# EAGLE design H09R00 (EAGLE 9.2.2)

## Sheet 1 of 2
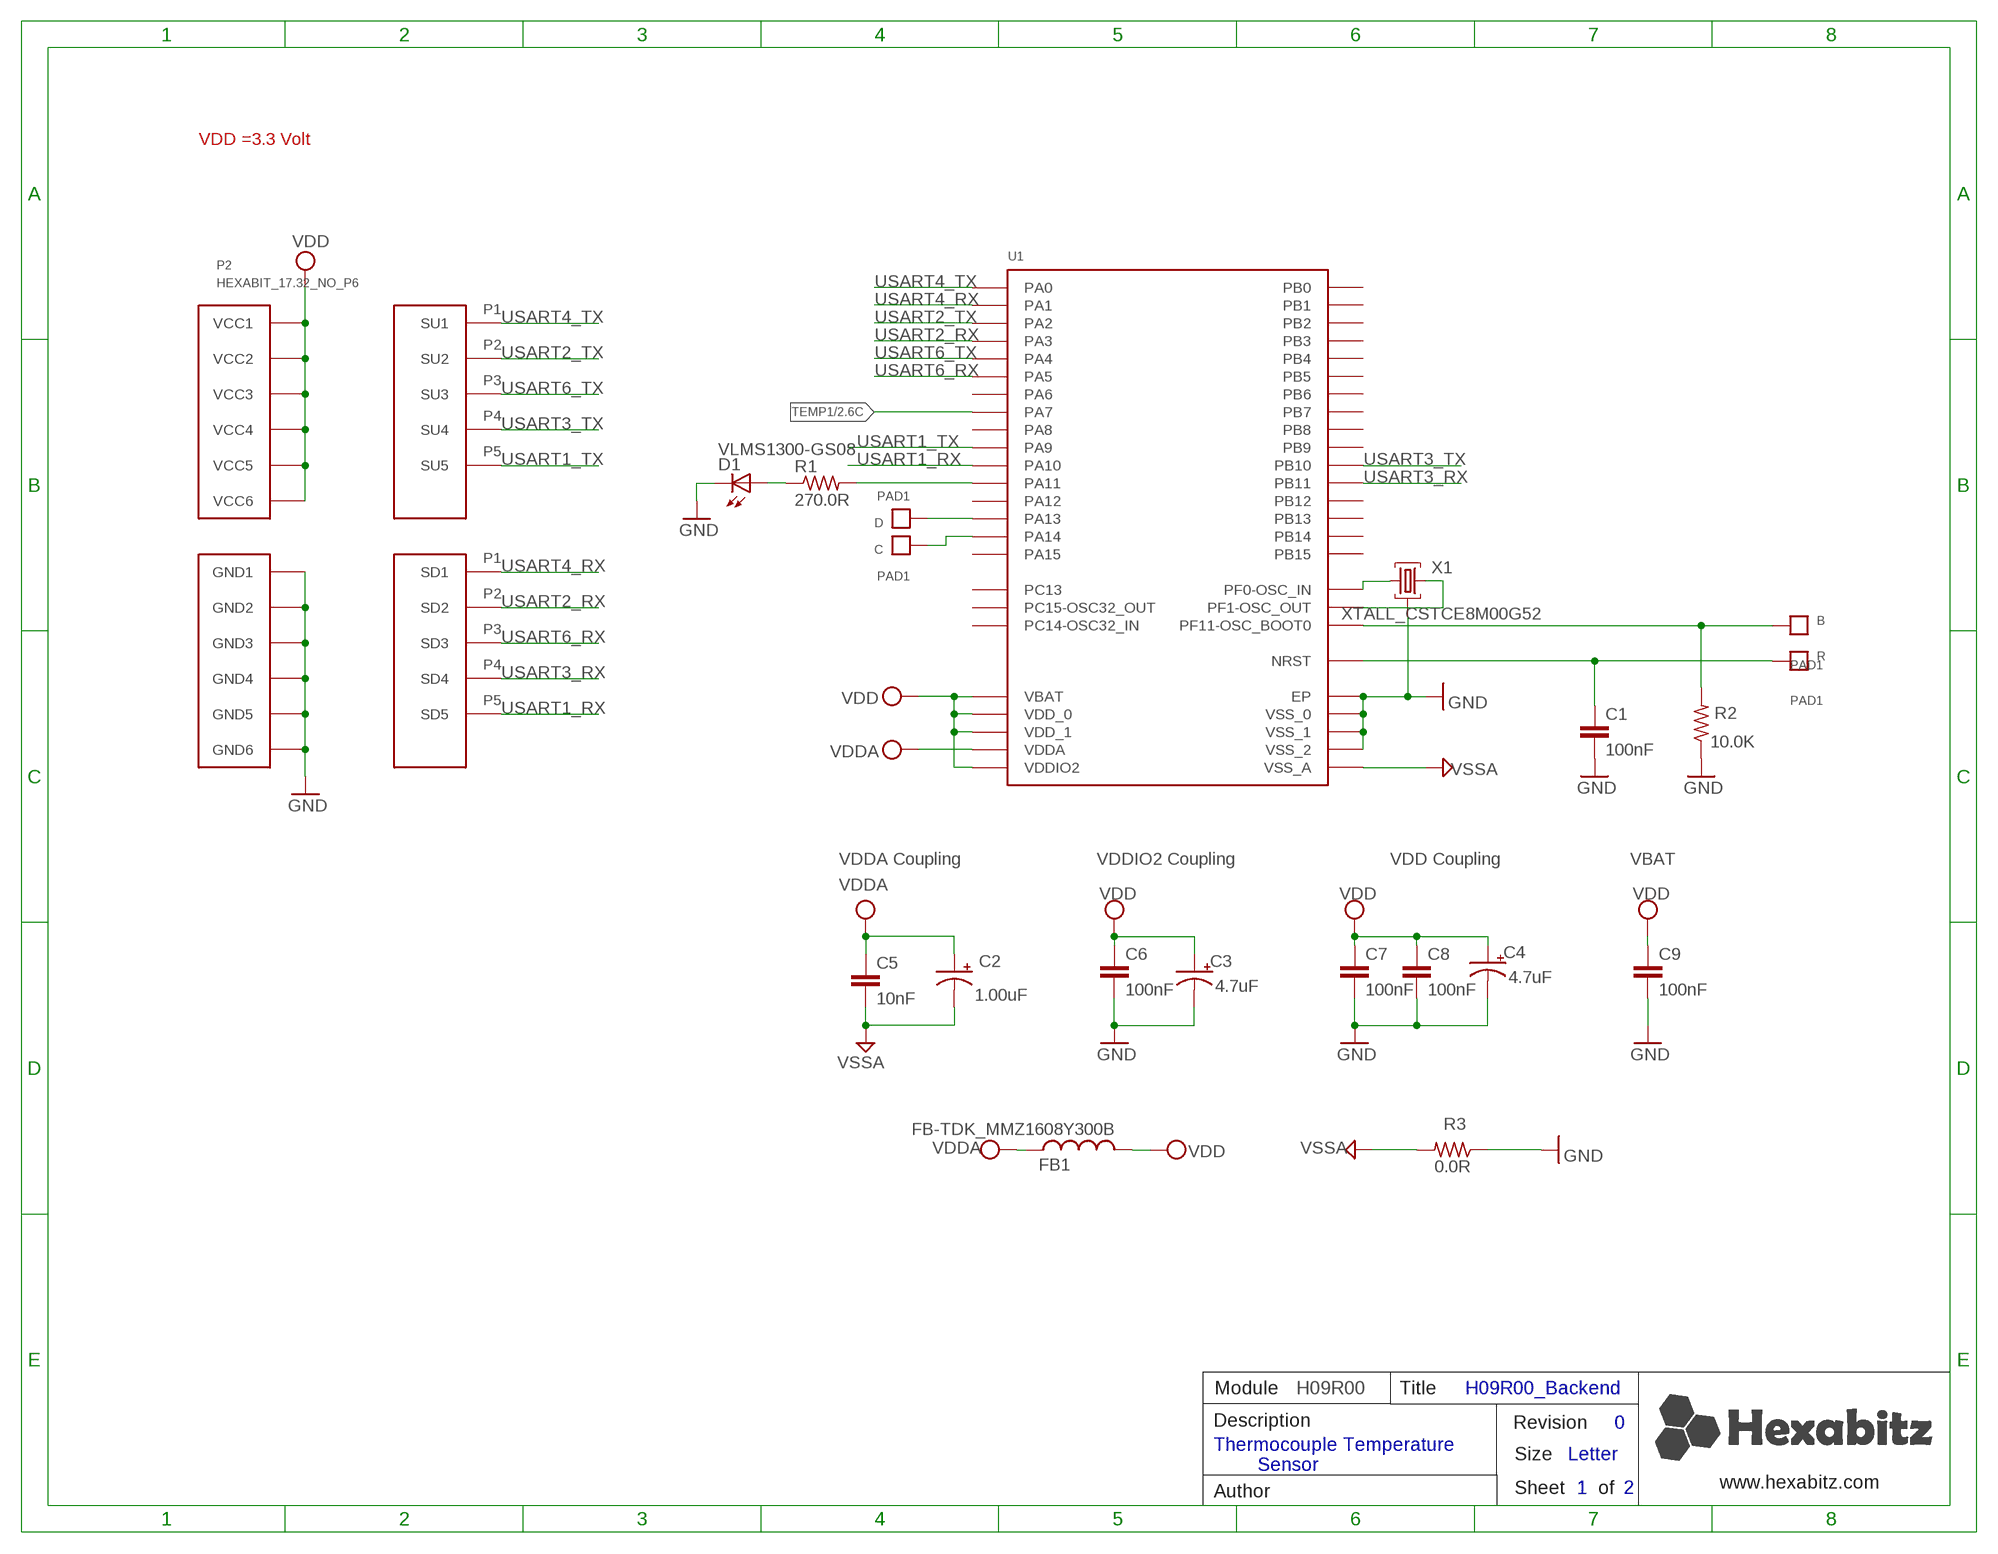
[diagram p0: schematic, sheet 1]

### Parts
B  PAD1  [PAD1]
C  PAD1  [PAD1]
C1  100nF  C-0603  [C-0603]
C2  1.00uF  C-0805-POL  [C-0805-POL]
C3  4.7uF  C-0805-POL  [C-0805-POL]
C4  4.7uF  C-0805-POL  [C-0805-POL]
C5  10nF  C-0603  [C-0603]
C6  100nF  C-0603  [C-0603]
C7  100nF  C-0603  [C-0603]
C8  100nF  C-0603  [C-0603]
C9  100nF  C-0603  [C-0603]
D  PAD1  [PAD1]
D1  VLMS1300-GS08  [VLMS1300-GS08]
FB1  FB-TDK_MMZ1608Y300B  [FB-TDK_MMZ1608Y300B]
P2  HEXABIT_17.32_NO_P6  [HEXABIT_17.32_NO_P6]
R  PAD1  [PAD1]
R1  270.0R  R-0603  [R-0603]
R2  10.0K  R-0603  [R-0603]
R3  0.0R  R-0603  [R-0603]
U1  STM32F091CBU6  [STM32F091CBU6]
X1  XTALL_CSTCE8M00G52  [XTALL_CSTCE8M00G52]

### Nets
B: B.P$1 B.P$2 R2.2 U1.P$44(PF11-OSC_BOOT0)
GND: C1.2 C3.2(-) C4.2(-) C6.2 C7.2 C8.2 C9.2 D1.C P2.7(GND1) P2.8(GND2) P2.9(GND3) P2.10(GND4) P2.11(GND5) P2.12(GND6) R2.1 R3.1 U1.EP U1.P$23(VSS_0) U1.P$35(VSS_1) U1.P$47(VSS_2) X1.P$2 ; also sheet 2
N$1: D.P$1 D.P$2 U1.P$34(PA13)
N$2: C.P$1 C.P$2 U1.P$37(PA14)
N$8: R1.2 U1.P$32(PA11)
N$10: D1.A R1.1
N$14: U1.P$5(PF0-OSC_IN) X1.P$1
N$15: U1.P$6(PF1-OSC_OUT) X1.P$3
R: C1.1 R.P$1 R.P$2 U1.P$7(NRST)
TEMP1: U1.P$17(PA7) ; also sheet 2
USART1_RX: P2.23(SD5) U1.P$31(PA10)
USART1_TX: P2.17(SU5) U1.P$30(PA9)
USART2_RX: P2.20(SD2) U1.P$13(PA3)
USART2_TX: P2.14(SU2) U1.P$12(PA2)
USART3_RX: P2.22(SD4) U1.P$22(PB11)
USART3_TX: P2.16(SU4) U1.P$21(PB10)
USART4_RX: P2.19(SD1) U1.P$11(PA1)
USART4_TX: P2.13(SU1) U1.P$10(PA0)
USART6_RX: P2.21(SD3) U1.P$15(PA5)
USART6_TX: P2.15(SU3) U1.P$14(PA4)
VDD: C3.1(+) C4.1(+) C6.1 C7.1 C8.1 C9.1 FB1.2 P2.1(VCC1) P2.2(VCC2) P2.3(VCC3) P2.4(VCC4) P2.5(VCC5) P2.6(VCC6) U1.P$1(VBAT) U1.P$24(VDD_0) U1.P$36(VDDIO2) U1.P$48(VDD_1) ; also sheet 2
VDDA: C2.1(+) C5.1 FB1.1 U1.P$9(VDDA)
VSSA: C2.2(-) C5.2 R3.2 U1.P$8(VSS_A)
Unconnected: U1.P$2(PC13) U1.P$3(PC14-OSC32_IN) U1.P$4(PC15-OSC32_OUT) U1.P$16(PA6) U1.P$18(PB0) U1.P$19(PB1) U1.P$20(PB2) U1.P$25(PB12) U1.P$26(PB13) U1.P$27(PB14) U1.P$28(PB15) U1.P$29(PA8) U1.P$33(PA12) U1.P$38(PA15) U1.P$39(PB3) U1.P$40(PB4) U1.P$41(PB5) U1.P$42(PB6) U1.P$43(PB7) U1.P$45(PB8) U1.P$46(PB9)

### Notes on the sheet
- VDD =3.3 Volt
- VDDA Coupling | VDDIO2 Coupling | VDD Coupling | VBAT
- Module | H09R00 | Title | H09R00_Backend
- Description | Revision | 0
- Size | Letter
- Thermocouple Temperature 
          Sensor
- 2 | www.hexabitz.com
- Author | Sheet      of | 1
- C:/Users/Admin/Desktop/logodraft.bmp

## Sheet 2 of 2
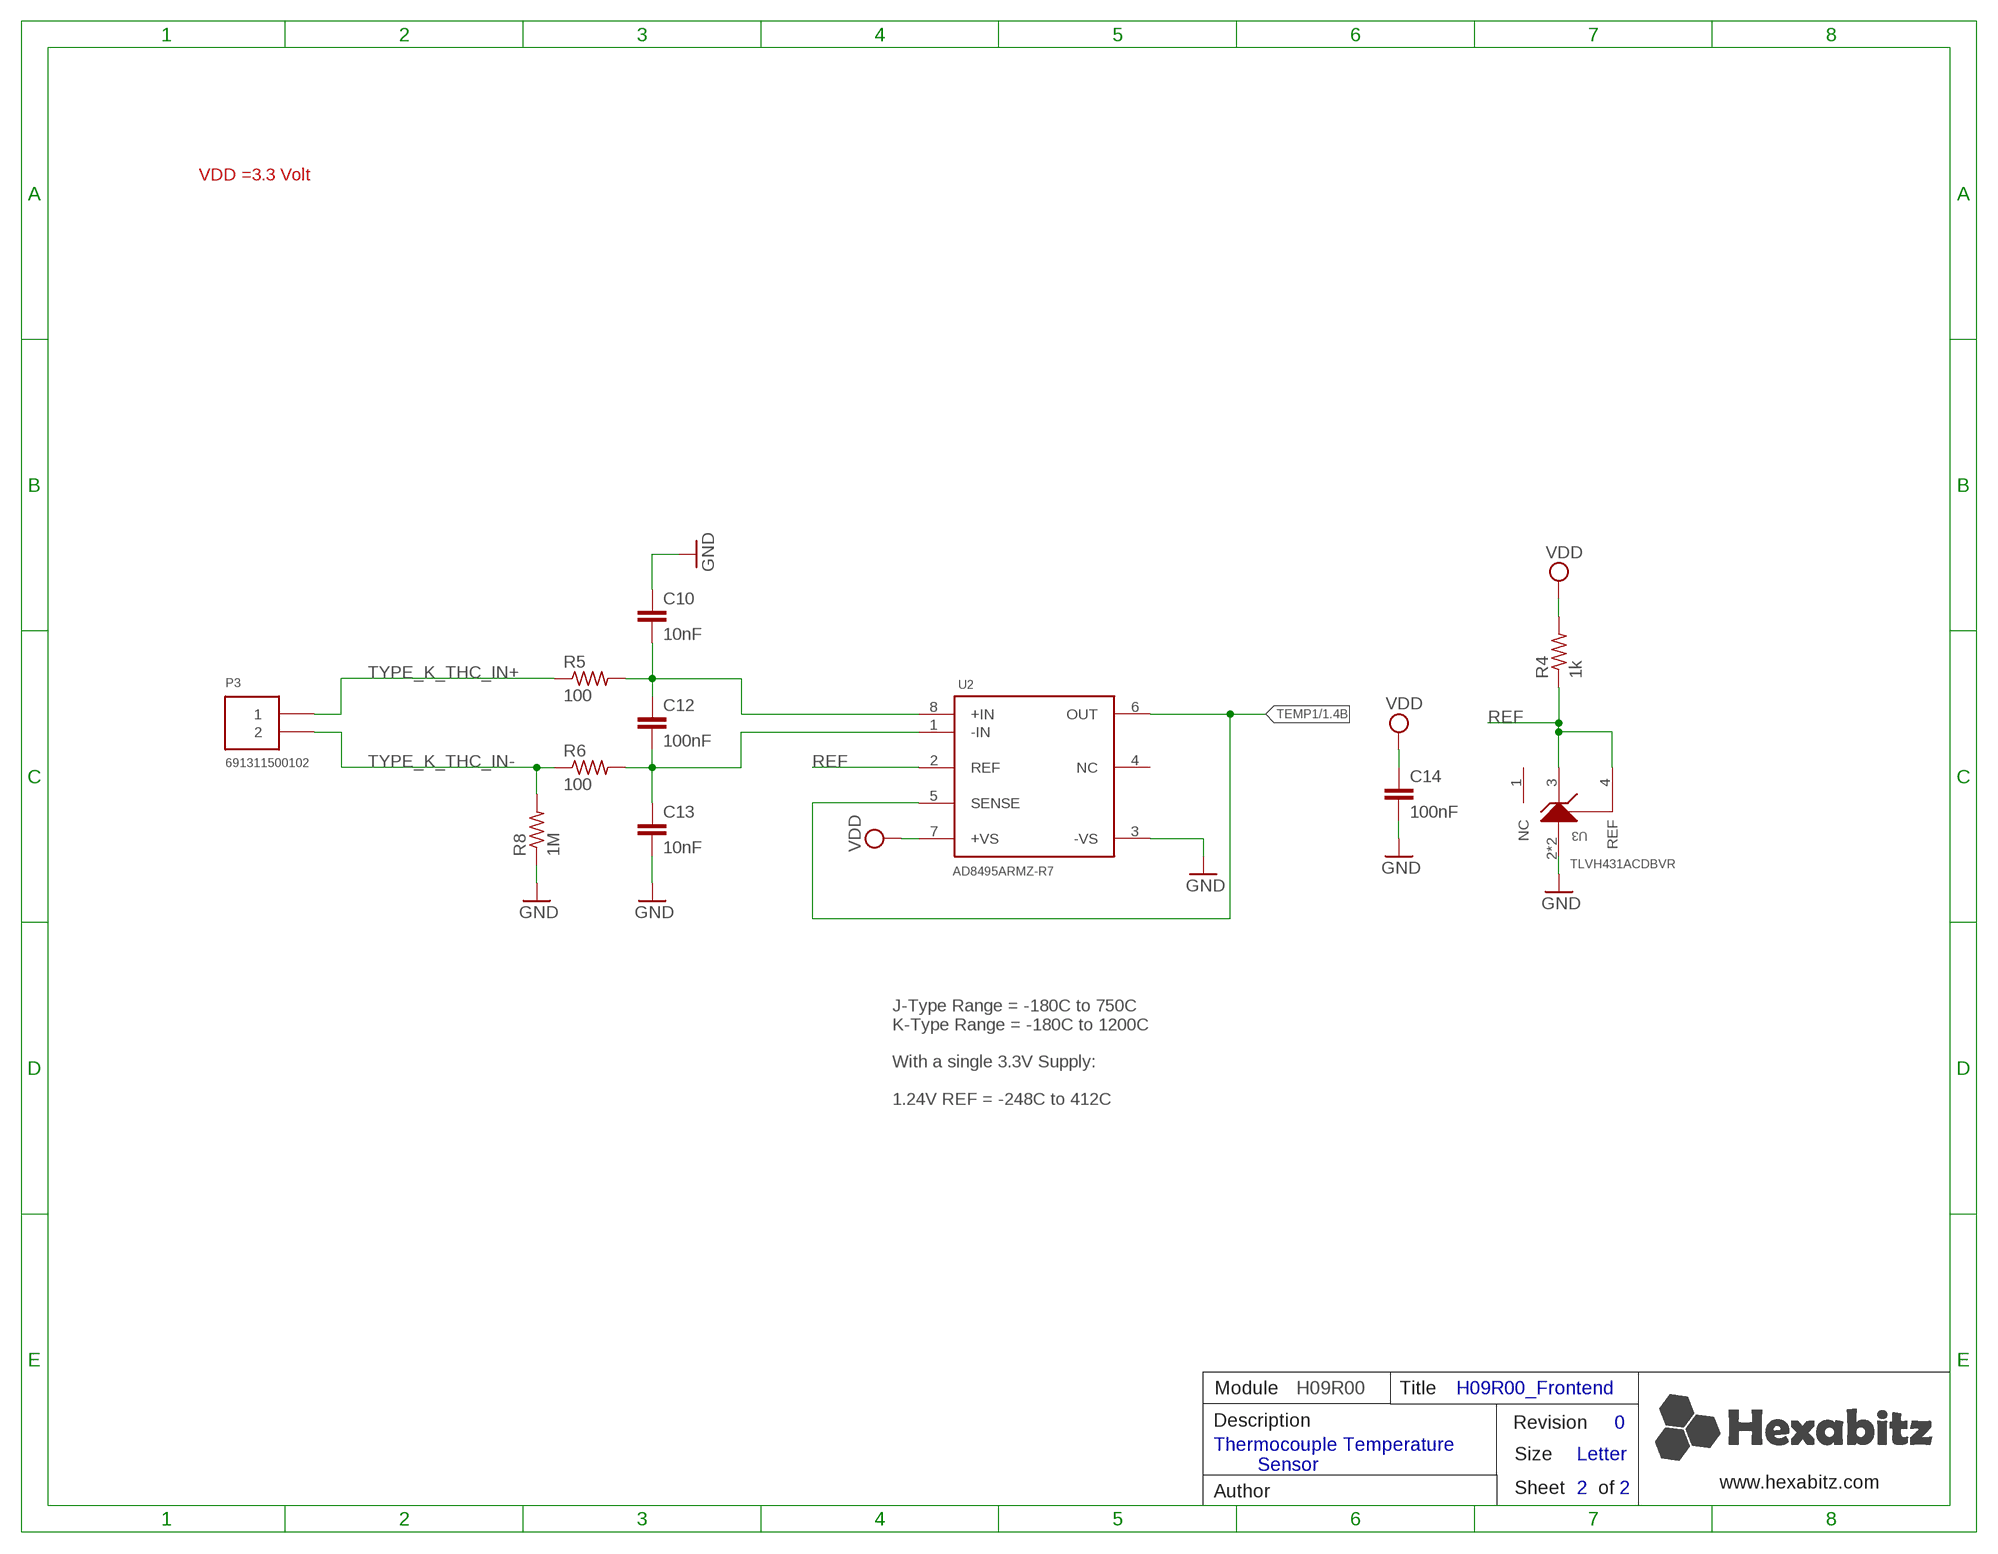
[diagram p1: schematic, sheet 2]

### Parts
C10  10nF  C-0603  [C-0603]
C12  100nF  C-0603  [C-0603]
C13  10nF  C-0603  [C-0603]
C14  100nF  C-0603  [C-0603]
P3  691311500102  [691311500102]
R4  1k  R-0402  [R-0402]
R5  100  R-0402  [R-0402]
R6  100  R-0402  [R-0402]
R8  1M  R-0402  [R-0402]
U2  AD8495ARMZ-R7  AD8495ARMZ  [AD8495ARMZ]
U3  TLVH431ACDBVR  [TLVH431ACDBVR]

### Nets
GND: C10.1 C13.2 C14.2 R8.1 U2.3(-VS) U3.2(ANODE) U3.5(ANODE) ; also sheet 1
N$3: C10.2 C12.1 R5.2 U2.8(+IN)
N$7: C12.2 C13.1 R6.2 U2.1(-IN)
REF: R4.1 U2.2(REF) U3.3(CATHODE) U3.4(REF)
TEMP1: U2.5(SENSE) U2.6(OUT) ; also sheet 1
TYPE_K_THC_IN+: P3.1 R5.1
TYPE_K_THC_IN-: P3.2 R6.1 R8.2
VDD: C14.1 R4.2 U2.7(+VS) ; also sheet 1
Unconnected: U2.4(NC) U3.1(NC)

### Notes on the sheet
- VDD =3.3 Volt
- J-Type Range = -180C to 750C
  K-Type Range = -180C to 1200C
  
  With a single 3.3V Supply:
  
  1.24V REF = -248C to 412C
- Module | H09R00 | Title | H09R00_Frontend
- Description | Revision | 0
- Size | Letter
- Thermocouple Temperature 
          Sensor
- www.hexabitz.com
- Author | Sheet      of | 2 | 2
- C:/Users/Admin/Desktop/logodraft.bmp

## Library data of the parts
B C D R = Hexabitz:PAD1
C1 C6 C8 C12 C14 = Hexabitz:C-0603: CAP CER 10% X7R 0603; CAPACITANCE: 100nF; MFN: KEMET; MPN: C0603C104K8RACTU; OCTOPART_URL: https://octopart.com/c0603c104k8ractu-kemet-145075?r=sp&s=9bS9ASSwSEqMCE9KBEQZ0g; TOLERANCE: 10%; VOLTAGE_RATING: 10V
C2 = Hexabitz:C-0805-POL: Cap Tant Solid SMD 2012; CAPACITANCE: 1.00uF; MFN: Yageo; MPN: CC0805KKX7R7BB105; OCTOPART_URL: https://octopart.com/cc0805kkx7r7bb105-yageo-8376555?r=sp&s=YKl1wwtkROau_X5nniH2ig; TOLERANCE: 10%; VOLTAGE_RATING: 16V
C3 C4 = Hexabitz:C-0805-POL: Cap Tant Solid SMD 2012; CAPACITANCE: 4.7uF; MFN: Murata; MPN: GRM21BC81E475KA12L; OCTOPART_URL: https://octopart.com/grm21bc81e475ka12l-murata-10331911?r=sp&s=RY3qZSD8T6mG6TC9CHI5qQ; TOLERANCE: 10%; VOLTAGE_RATING: 25V
C5 C10 C13 = Hexabitz:C-0603: CAP CER 10% X7R 0603; CAPACITANCE: 10nF; MFN: KEMET; MPN: C0603C103K5RACTU; OCTOPART_URL: https://octopart.com/c0603c103k5ractu-kemet-133094?r=sp&s=R_iPBxLnSmGqhkU2rIMFpg; TOLERANCE: 10%; VOLTAGE_RATING: 50V
C7 = Hexabitz:C-0603: CAP CER 10% X7R 0603; CAPACITANCE: 100nF; MFN: KEMET; MPN: C0603C104K8RACTU; OCTOPART_URL: https://octopart.com/c0603c104k8ractu-kemet-145075?r=sp&s=9bS9ASSwSEqMCE9KBEQZ0g; TOLERANCE: 10%; VOLTAGE_RATING: 10
C9 = Hexabitz:C-0603: CAP CER 10% X7R 0603; CAPACITANCE: 100nF; MFN: KEMET; MPN: C0603C104K8RACTU; OCTOPART_URL: https://octopart.com/c0603c104k8ractu-kemet-145075?r=sp&s=9bS9ASSwSEqMCE9KBEQZ0g; TOLERANCE: 10V; VOLTAGE_RATING: 10%
D1 = Hexabitz:VLMS1300-GS08: Red 0603 130° Clear 54 mcd 2 V Surface Mount ChipLED ; Octopart Url : http://octopart.com/vlms1300-gs08-vishay-21709201; MFN: Vishay; MPN: VLMS1300-GS08; OCTOPART_URL: https://octopart.com/vlms1300-gs08-vishay-21709201?r=sp&s=_gcP4_q8T1SC6PJQPTQ9yA
FB1 = Hexabitz:FB-TDK_MMZ1608Y300B: Ferrite Beads Multi-Layer 30Ohm 25% 100MHz 1.5A 50mOhm DCR 0603; MFN: TDK; MPN: MMZ1608Y300B; OCTOPART_URL: https://octopart.com/mmz1608y300b-tdk-368280?r=sp&s=cd9_2ZEqQ9q9UNBuQgHAiA
P2 = Hexabitz:HEXABIT_17.32_NO_P6: HEXABIT CONNECTOR
P3 = Hexabitz:691311500102: Description : Pin header, straight Series WR-TBL / 311 Solder Pin [PCB, Through-Hole] 2P; MFN: 691311500102; MPN: Wurth Electronics Inc.; OCTOPART_URL: https://octopart.com/search?q=691311500102&start=0
R1 = Hexabitz:R-0603: Thick Film Resistors - SMD 0603; MFN: Yageo; MPN: RC0603FR-07270RL; OCTOPART_URL: https://octopart.com/search?q=RC0603FR-07270RL&start=0; RESISTANCE: 270.0 Ohm; TOLERANCE: 1%
R2 = Hexabitz:R-0603: Thick Film Resistors - SMD 0603; MFN: Yageo; MPN: RC0603JR-0710KL; OCTOPART_URL: https://octopart.com/search?q=RC0603JR-0710KL&start=0; RESISTANCE: 10.0K Ohm; TOLERANCE: 5%
R3 = Hexabitz:R-0603: Thick Film Resistors - SMD 0603; MFN: Yageo; MPN: RC0603JR-070RL; OCTOPART_URL: https://octopart.com/rc0603jr-070rl-yageo-1241539?r=sp&s=X2NteqRjRNWrnx42Y0aliA; RESISTANCE: 0.0 Ohm
R4 = Hexabitz:R-0402: Thick Film Resistors - SMD 0603; MFN: Yageo; MPN: RC0402FR-071KL; OCTOPART_URL: https://octopart.com/search?q=RC0402FR-071KL&start=0; RESISTANCE: 1k; TOLERANCE: 1%
R5 R6 = Hexabitz:R-0402: Thick Film Resistors - SMD 0603; MFN: Yageo; MPN: RC0402FR-07100RL; OCTOPART_URL: https://octopart.com/search?q=RC0402FR-07100RL&start=0; RESISTANCE: 100; TOLERANCE: 1%
R8 = Hexabitz:R-0402: Thick Film Resistors - SMD 0603; MFN: Yageo; MPN: RC0402FR-071ML; OCTOPART_URL: https://octopart.com/search?q=RC0402FR-071ML&start=0; RESISTANCE: 1M; TOLERANCE: 1%
U1 = Hexabitz:STM32F091CBU6: Description : ARM-based 32-bit MCU, CAN, 12 timers, ADC, DAC & Comm. Interface, 2 to 3.6 V, -40 to 85 degC, 48-Pin UFQFPN, RoHS, Tray ;Parameter : Ciiva URL : https://ciiva.com/part/STM32F091CBU6-20240708, CiivaID : 20240708, Clock Speed : 48000000.0 Hz, Lifecycle Status : Active, Mounting Style : Surface Mount, Number of Pins : 48, Octopart Url : https://octopart.com/stm32f091cbu6-stmicroelectronics-51988677, OctopartID : 5f4f955c32ec8088, RAM Memory Size : 32768 B, REACH SVHC Compliance : No SVHC, RoHS : Compliant,; MFN: STMicroelectronics; MPN: STM32F091CBU6; OCTOPART_URL: https://octopart.com/stm32f091cbu6-stmicroelectronics-51988677?r=sp&s=bU6fpgsrTZOxHyt7jkfh3w
U2 = Hexabitz:AD8495ARMZ: Description : IC THERMOCOUPLE A W/COMP 8MSOP; MFG: Analog Devices; MPN: AD8495ARMZ-R7; OCTOPART_URL: https://octopart.com/search?q=AD8495ARMZ-R7&start=0
U3 = Hexabitz:TLVH431ACDBVR: LOW-VOLTAGE ADJUSTABLE PRECISION SHUNT REGULATORS; MFN: Texas Instruments; MPN: TLVH431ACDBVR; OCTOPART_URL: https://octopart.com/search?q=TLVH431ACDBVR&start=0
X1 = Hexabitz:XTALL_CSTCE8M00G52: MURATA CSTCE8M00G52-R0 RESONATOR, SMD, 8MHZ ; Octopart Url : https://octopart.com/cstce8m00g52-r0-murata-7145559; MFN: Murata; MPN: CSTCE8M00G52Z-R0; OCTOPART_URL: https://octopart.com/cstce8m00g52z-r0-murata-17755941?r=sp&s=JDnNJnrHQhyS8Zk4ofFWXw

## Board
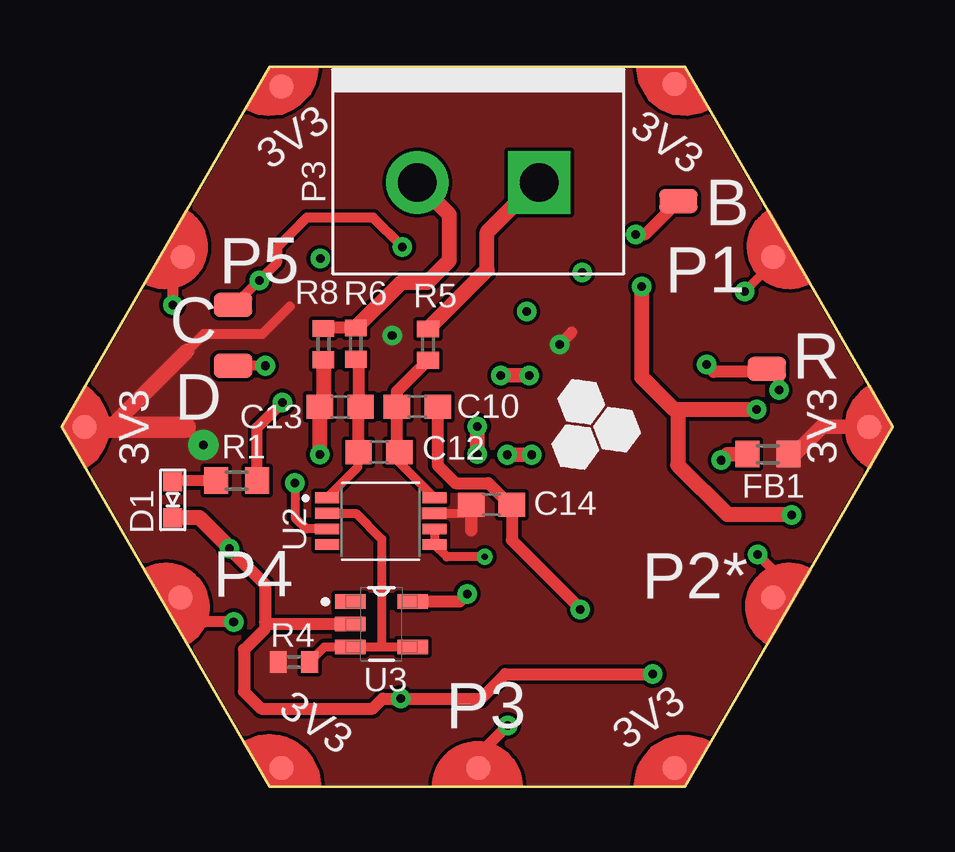
[diagram p2: board, top side]
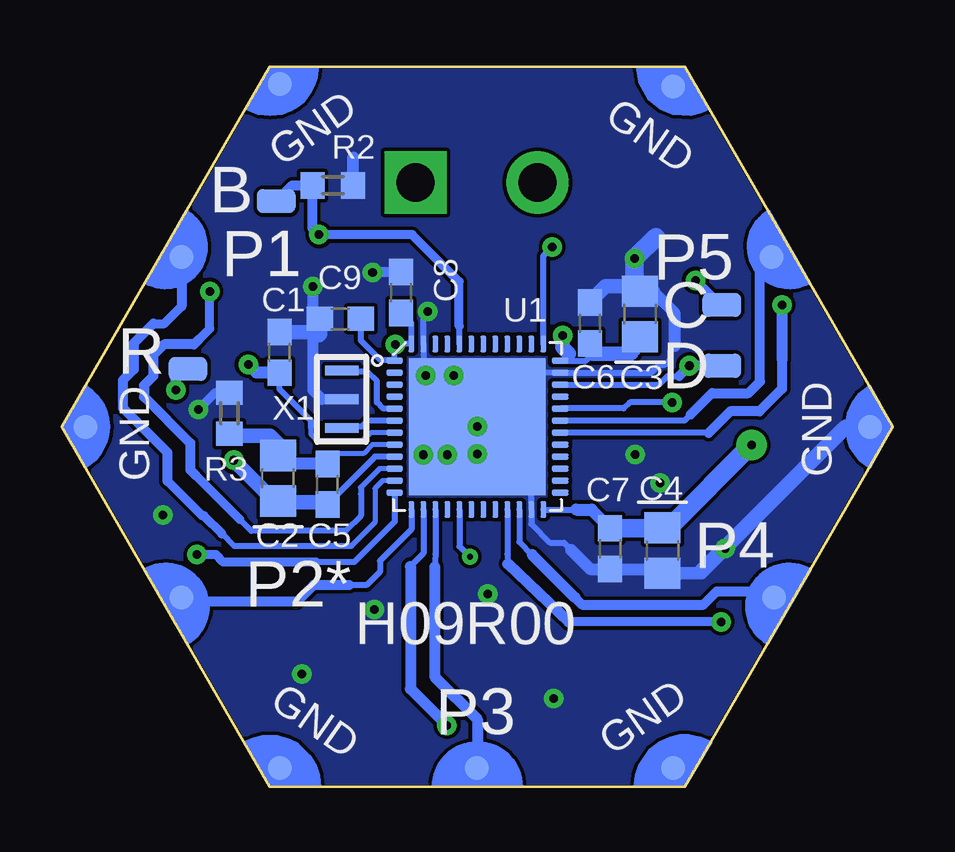
[diagram p3: board, bottom side, seen from below]

Size 34.64 x 30 mm. Coordinates in mm from the lower left corner, seen from the top.
Copper layers (1*16): Top 0.035mm / dielectric 1.5mm / Bottom 0.035mm
Design rules "default *": minimum track width 7mil, minimum drill 10mil, track to track 6mil, track to pad 6mil, pad to pad 6mil, via to via 6mil, smd to smd 0mil, copper to edge 1mil, drill to drill 8mil, minimum pad ring 10mil, minimum via ring 8mil, stop-mask expansion 2mil, vias tented up to drill 15mil, thermal gap 10mil

### Footprints (pad centres in the part's own frame; a part is rotated, then mirrored left to right if it is on the bottom)
PAD1 = smd 1.6 x 1: P$1 0,0 | smd 1.6 x 1 bottom: P$2 0,0
C-0603 = smd 1.1 x 1: 1 -0.85,0; 2 0.85,0
C-0805-POL = smd 1.3 x 1.5: 1 -0.95,0; 2 0.95,0
VLMS1300-GS08 = smd 0.8 x 0.8: A 0,0.75; C 0,-0.75
FB-TDK_MMZ1608Y300B = smd 1 x 1.1: 1 -0.85,0; 2 0.85,0
HEXABIT_17.32_NO_P6 = smd 1 x 1: 1 8.23,14.28; 2 16.33,-0.02; 3 8.23,-14.22; 4 -8.17,-14.22; 5 -16.37,-0.02; 6 -8.17,14.18; 13 12.33,7.08; 14 12.33,-7.12; 15 0.03,-14.22; 16 -12.37,-7.12; 17 -12.27,7.08 | smd 1 x 1 bottom: 7 8.23,14.28; 8 16.33,-0.02; 9 8.23,-14.22; 10 -8.17,-14.22; 11 -16.37,-0.02; 12 -8.17,14.18; 19 12.33,7.08; 20 12.33,-7.12; 21 0.03,-14.22; 22 -12.37,-7.12; 23 -12.27,7.08
691311500102 = drill 1.6 pad 2.6 square: 1 -2.54,0 | drill 1.6 pad 2.6: 2 2.54,0
R-0603 = smd 1 x 1.1: 1 -0.85,0; 2 0.85,0
R-0402 = smd 0.7 x 0.9: 1 -0.65,0; 2 0.65,0
STM32F091CBU6 = smd 5.7 x 5.7: EP 0,0 | smd 0.25 x 0.7: P$1 -2.75,-3.45; P$2 -2.25,-3.45; P$3 -1.75,-3.45; P$4 -1.25,-3.45; P$5 -0.75,-3.45; P$6 -0.25,-3.45; P$7 0.25,-3.45; P$8 0.75,-3.45; P$9 1.25,-3.45; P$10 1.75,-3.45; P$11 2.25,-3.45; P$12 2.75,-3.45; P$25 2.75,3.45; P$26 2.25,3.45; P$27 1.75,3.45; P$28 1.25,3.45; P$29 0.75,3.45; P$30 0.25,3.45; P$31 -0.25,3.45; P$32 -0.75,3.45; P$33 -1.25,3.45; P$34 -1.75,3.45; P$35 -2.25,3.45; P$36 -2.75,3.45 | smd 0.7 x 0.25: P$13 3.45,-2.75; P$14 3.45,-2.25; P$15 3.45,-1.75; P$16 3.45,-1.25; P$17 3.45,-0.75; P$18 3.45,-0.25; P$19 3.45,0.25; P$20 3.45,0.75; P$21 3.45,1.25; P$22 3.45,1.75; P$23 3.45,2.25; P$24 3.45,2.75; P$37 -3.45,2.75; P$38 -3.45,2.25; P$39 -3.45,1.75; P$40 -3.45,1.25; P$41 -3.45,0.75; P$42 -3.45,0.25; P$43 -3.45,-0.25; P$44 -3.45,-0.75; P$45 -3.45,-1.25; P$46 -3.45,-1.75; P$47 -3.45,-2.25; P$48 -3.45,-2.75
AD8495ARMZ = smd 0.45 x 1: 1 -0.975,-2.244; 2 -0.325,-2.244; 3 0.325,-2.244; 4 0.975,-2.244; 5 0.975,2.244; 6 0.325,2.244; 7 -0.325,2.244; 8 -0.975,2.244
TLVH431ACDBVR = smd 1.27 x 0.6: 1 -1.3,0.95; 2 -1.3,0; 3 -1.3,-0.95; 4 1.3,-0.95; 5 1.3,0.95
XTALL_CSTCE8M00G52 = smd 1.4 x 0.4: P$1 0,1.2; P$2 0,0; P$3 0,-1.2

### Placement (x,y rotation side)
B  25.7,24.4 0 top
C  7.13,20.08 0 top
C1  25.57,18.1 90 bottom
C2  25.63,12.85 90 bottom
C3  10.54,19.69 90 bottom
C4  9.6,9.84 270 bottom
C5  23.57,12.6 90 bottom
C6  12.62,19.32 90 bottom
C7  11.78,9.92 270 bottom
C8  20.5,20.59 90 bottom
C9  23.04,19.5 180 bottom
C10  14.82,15.84 180 top
C12  13.22,13.94 180 top
C13  11.6,15.83 180 top
C14  17.91,11.75 0 top
D  7.13,17.54 0 top
D1  4.62,11.95 0 top
FB1  29.43,13.86 0 top
P2  17.32,15 0 top
P3  17.36,25.18 180 top
R  29.39,17.41 0 top
R1  7.29,12.75 0 top
R2  23.35,25.06 180 bottom
R3  27.66,15.56 270 bottom
R4  9.67,5.2 180 top
R5  15.27,18.42 270 top
R6  12.25,18.46 270 top
R8  10.9,18.44 90 top
U1  17.32,15 270 bottom
U2  13.29,11.06 270 top
U3  13.32,6.77 0 top
X1  22.98,16.14 0 bottom

### Tracks (layer width: path | path; a pad name or v marks a point on that pad's centre or on a via)
B  (via drill 0.36 pad 0.81)
  Top 0.508: B.P$1 24.3,23 v23.92,23
  Bottom 0.254: U1.P$44 18.07,19.18 18.08,19.19
  Bottom 0.381: 18.08,19.19 18.08,21.05 20.04,23 v23.92,23
  Bottom 0.406: v23.92,23 24.2,23.27 R2.2 25.04,25.06 B.P$1
  Bottom 0.508: B.P$1 arc90 25.68,24.37
GND  (via drill 0.36 pad 0.81)
  Top 0.381: U2.3 10.19,10.74 9.73,11.2 9.73,12.63 v9.71,12.66 | v10.75,13.85 v10.75,13.86
  Top 0.508: v6.98,9.92 8.46,8.44 8.46,6.86 | 8.46,6.86 8.46,6.58 7.59,5.71 7.59,3.96 8.31,3.25 12.95,3.25 13.37,3.67 v14.13,3.67 17.47,3.67 18.49,4.69 v24.64,4.69 | U3.5 16.59,7.72 16.92,8.05 16.91,8.05 v16.89,8.03 | C10.1 15.67,13.4 16.41,12.65 17.78,12.65 18.69,11.75 C14.2 18.76,10.27 21.67,7.37 21.63,7.37 v21.61,7.38 | 8.46,6.86 8.55,6.77 U3.2
  Top 0.61: D1.C 4.89,11.2 | v18.3,17.14 v19.48,17.14 | v19.58,13.83 v18.57,13.83
  Top 0.635: D1.C 4.63,11.21 5.74,11.21 7.01,9.95 v6.98,9.92 7.03,9.92 | v24.18,20.84 24.18,17.06 25.52,15.71 v28.95,15.71 25.68,15.71 25.68,13.4 27.73,11.34 30.43,11.34 v30.43,11.32 | v17.32,13.86 U1.EP | v10.75,13.86 C13.2 10.9,15.99 R8.1
  Bottom 0.254: v17.32,15.01 19.57,17.25 U1.P$47 19.57,19.61 19.35,19.83 | v18.3,17.14 15,17.25 U1.P$35 10.07,17.25 9.72,17.59 9.5,17.59 9.27,17.82 9.27,18.18 9.09,18.35 | v19.48,17.14 16.3,17.29 | v17.32,13.86 16.68,13.22 15.29,13.22 15.07,13 U1.P$23 15.07,10.95 14.3,10.17 13.71,10.17 13.41,9.87
  Bottom 0.356: X1.P$2 23.8,16.14
  Bottom 0.381: R3.1 28.26,16.41 v28.95,15.71 | C4.2 9.51,8.98
  Bottom 0.406: C8.2 21.66,21.44 21.66,21.43
  Bottom 0.457: 23.8,16.14 24.18,16.52 24.18,18.68 24.43,18.94 | C1.2 24.22,18.9 24.18,18.94 v24.18,20.84 | 19.57,17.25 19.39,17.25 v19.58,13.83 | v18.57,13.83 18.08,17.29
  Bottom 0.508: 13.41,9.87 12.61,9.07 C7.2 9.6,9.07 C4.2 | R2.1 22.5,26.23 | 8.06,8.89 C4.2 | C4.2 7.97,8.89 7.97,8.98 | 9.09,18.35 9.09,19.72 10.01,20.64
  Bottom 0.61: C6.2 12.62,20.21 11.99,20.84 11.04,20.84 C3.2 10.01,20.64 | C9.2 23.89,18.85 23.92,18.81 23.92,18.94 24.18,18.94 24.43,18.94 24.99,18.94 C1.2 | v17.32,13.86 v17.32,15.01 17.32,16.14 | 17.32,17.29 16.3,17.29
  Bottom 0.635: 9.78,9.07 C4.2 | 7.97,8.98 1.97,14.98
  Bottom 0.762: 11.04,20.84 10.77,21.12 v10.77,22.01 9.88,22.9
  other vias: 21.69,21.43 19.38,19.8
  pour Bottom (no thermals): 0.05,15 8.68,29.99 25.96,29.99 34.59,15 25.96,0.01 8.68,0.01
N$1  (via drill 0.36 pad 0.81)
  Top 0.406: v8.48,17.54 D.P$1
  Bottom 0.254: U1.P$34 9.75,16.75 9.39,17.11 8.91,17.11
  Bottom 0.406: 8.91,17.11 v8.48,17.54 D.P$1
N$2  (via drill 0.36 pad 0.81)
  Top 0.406: v14.2,22.49 12.98,23.71 10.21,23.71 8.96,22.47 8.96,21.83 v8.23,21.1 7.21,20.08 C.P$1
  Bottom 0.254: U1.P$37 14.57,22.12 v14.2,22.49
  Bottom 0.406: v8.23,21.1 7.21,20.08 C.P$1
N$3
  Top 0.381: U2.8 14.07,13.5 C12.1
  Top 0.508: C12.1 13.97,14.05 C10.2 13.97,16.47 R5.2
N$7
  Top 0.381: U2.1 12.34,13.33 12.34,13.91 C12.2
  Top 0.508: C12.2 12.37,15.75 | 12.37,15.75 C13.1 | R6.2 12.37,17.69 12.37,15.75
N$8  (via drill 0.36 pad 0.81)
  Top 0.457: R1.2 8.14,14.96 v9.19,16.02
  Bottom 0.254: v9.19,16.02 10.97,16.02 11.22,15.76 13.86,15.76 U1.P$32
N$10
  Top 0.457: R1.1 4.67,12.75 D1.A
N$14
  Bottom 0.254: U1.P$5 21.25,15.75 21.51,16.02 21.51,16.91 21.89,17.29 22.92,17.29 X1.P$1
N$15
  Bottom 0.254: U1.P$6 21.9,15.25 22.15,15 22.92,15 X1.P$3
R  (via drill 0.36 pad 0.81)
  Top 0.406: 29.26,17.29 R.P$1
  Top 0.457: v29.89,16.52 29.89,17.29 29.51,17.29 R.P$1
  Top 0.508: 29.26,17.29 27.18,17.29 v26.87,17.59
  Bottom 0.203: U1.P$7 21.76,14.75 22.09,14.42 23.98,14.42 24.25,14.7 24.25,14.97
  Bottom 0.254: 26.91,17.45 v26.87,17.59 | 24.25,14.97 24.25,15.25 25.57,16.57 C1.1
  Bottom 0.457: R.P$1 29.64,17.41 29.89,17.16 v29.89,16.52
  Bottom 0.508: C1.1 26.53,17.25 v26.87,17.59
REF
  Top 0.381: U2.2 12.26,11.39 13.34,10.31 13.34,5.85 13.31,5.82 | 13.31,5.82 12.27,5.82 U3.3 10.95,5.82 R4.1 | 13.31,5.82 U3.4
TEMP1  (via drill 0.25 pad 0.51)
  Top 0.381: v17.63,9.58 16.05,9.58 U2.5 U2.6
  Bottom 0.254: U1.P$17 18.07,10.02 v17.63,9.58
TYPE_K_THC_IN+
  Top 0.635: R5.1 17.73,21.54 17.73,23.11 19.8,25.18 P3.1
TYPE_K_THC_IN-
  Top 0.508: R6.1 10.93,19.11 R8.2
  Top 0.635: R6.1 14.15,21.02 15.24,21.02 16.15,21.93 16.15,23.84 P3.2
USART1_RX
  Bottom 0.254: 8.43,15.51 8.68,15.25 U1.P$31
  Bottom 0.406: 8.43,15.51 7.54,16.4 6.02,16.4 5.53,16.88 5.53,21.6 5.05,21.6 P2.23
USART1_TX  (via drill 0.36 pad 0.81)
  Top 0.406: P2.17 4.84,22.08
  Top 0.457: 4.62,21.86 4.37,21.6 | 4.84,22.08 4.62,21.86 | 4.62,21.86 v4.62,20.08
  Bottom 0.254: 7.67,14.75 U1.P$30
  Bottom 0.406: 4.62,17.79 4.62,16.57 5.56,15.63 6.78,15.63 7.67,14.75
  Bottom 0.457: v4.62,20.08 4.62,17.79
USART2_RX
  Bottom 0.254: U1.P$13 20.07,10.73 21.38,9.41 21.38,8.96 21.94,8.4 22.65,8.4
  Bottom 0.406: 22.65,8.4 24.15,8.4 24.84,7.71 29.48,7.71 P2.20
USART2_TX  (via drill 0.36 pad 0.81)
  Top 0.406: 29.77,7.88 P2.14 29.65,9.02 v29,9.67
  Top 0.508: 29.77,7.88 29.77,8
  Bottom 0.254: U1.P$12 20.77,11.04 22.45,9.36 24.05,9.36
  Bottom 0.381: 24.05,9.36 27.91,9.36 28.22,9.67 v29,9.67
USART3_RX
  Bottom 0.254: U1.P$22 15.57,10.2 15.03,9.67
  Bottom 0.406: 13.25,7.88 12.95,7.58 7.9,7.58 7.34,8.14 4.95,8.14 P2.22
  Bottom 0.457: 13.25,7.88 15.03,9.67
USART3_TX  (via drill 0.36 pad 0.81)
  Top 0.406: 4.95,7.79 5.23,7.51 5.23,7.58 4.98,7.84 | 4.98,7.84 4.99,7.84 5.96,6.87 | 4.98,7.84 4.95,7.84 P2.16
  Top 0.457: v7.16,6.87 5.96,6.87
  Bottom 0.254: U1.P$21 16.07,9.69 16.05,9.29
  Bottom 0.381: v7.16,6.87 13.51,6.87
  Bottom 0.457: 16.05,9.29 13.51,6.87
USART4_RX
  Bottom 0.203: U1.P$11 21.27,12.75 21.59,12.44 21.59,11.01 22.58,10.02
  Bottom 0.254: 22.58,10.02 27.45,10.02 27.96,10.53
  Bottom 0.381: 27.96,10.53 28.73,11.29 28.8,11.29 30.25,12.74 | 30.83,19.29 30.38,19.29 29.65,20.02
  Bottom 0.406: 30.83,19.29 31.65,18.48 31.65,17.39 32.1,16.93 32.1,15.79 30.25,13.93 30.25,12.74 | P2.19 29.65,20.02
USART4_TX  (via drill 0.36 pad 0.81)
  Top 0.381: v28.47,20.64 29.65,21.82
  Top 0.406: 29.65,21.82 P2.13
  Bottom 0.203: U1.P$10 21.41,13.25 22.17,12.48 22.17,12.21
  Bottom 0.254: 22.17,12.46 22.17,12.21 22.17,11.29 22.81,10.66 26.74,10.66 27.23,11.14
  Bottom 0.381: 27.23,11.14 29.07,12.98 | v28.47,20.64 28.47,19.09 28.95,18.61
  Bottom 0.406: 28.95,18.61 29.13,18.43 30.38,18.43 30.83,17.97 30.83,17.11 31.21,16.73 31.21,16.25 29.28,14.31 29.28,13.2 29.07,12.98
USART6_RX
  Bottom 0.254: U1.P$15 19.07,9.69 19.1,9.16
  Bottom 0.406: 17.32,0.81 17.35,0.81 P2.21
  Bottom 0.457: 19.1,9.16 19.1,4.59 17.32,2.81 17.32,0.81
USART6_TX  (via drill 0.36 pad 0.81)
  Top 0.406: 17.35,1.31 P2.15
  Top 0.457: 17.35,1.31 v18.59,2.55
  Bottom 0.254: U1.P$14 19.57,9.73 20.11,9.18
  Bottom 0.457: v18.59,2.55 20.11,4.08 20.11,9.18
VDD  (via drill 0.36 pad 0.81, 0.36 pad 1.27)
  Top 0.381: U2.7 16.7,11.39 C14.1
  Top 0.406: 5.15,14.98 v5.89,14.24 | 9.5,20 8.35,18.86 5.92,18.86 5.2,18.15
  Top 0.457: v20.75,18.43 21.26,18.94
  Top 0.508: C14.1 17.06,10.68 17.07,10.67
  Top 0.61: 31.67,15 33.63,15
  Top 0.635: 5.2,18.15 2.04,14.98 1.55,14.98 | 31.67,15 30.53,13.86 FB1.2
  Top 0.762: 5.15,14.98 5.14,14.97
  Top 0.889: 5.15,14.98 1.55,14.98
  Bottom 0.254: C6.1 12.62,17.92 12.79,17.75 U1.P$36 13.55,17.75 13.51,17.79 13.51,18.05 | U1.P$24 13.2,11.55 | C9.1 22.18,18.59 21.38,17.79 20.81,17.79 U1.P$1 20.77,18.41 v20.75,18.43 20.73,18.45 U1.P$48 20.07,19.31 C8.1
  Bottom 0.381: C3.1 10.7,18.89 10.31,18.89
  Bottom 0.508: 13.2,11.55 12.56,11.55 C7.1
  Bottom 0.61: C6.1 12.62,18.18 12.49,18.05 10.97,18.05 | 13.51,18.05 13.76,18.3 v13.76,18.81 | 6.39,13.74 v5.89,14.24
  Bottom 0.635: 10.97,18.05 10.84,18.18 C3.1
  Bottom 0.762: C7.1 9.62,10.77 C4.1 9.33,10.79 v5.89,14.24
  pour Top (no thermals): 8.68,29.99 0.05,15 8.68,0.01 25.96,0.01 34.59,15 25.96,29.99
VDDA  (via drill 0.36 pad 0.81)
  Top 0.61: v27.48,13.6 27.73,13.86 FB1.1
  Bottom 0.254: U1.P$9 21.59,13.75 23.49,11.85 C5.1
  Bottom 0.61: v27.48,13.6 25.86,11.98 C2.1 24.9,11.85 23.57,11.85 C5.1
VSSA
  Bottom 0.203: U1.P$8 21.7,14.25 22.07,13.88 23.29,13.88 C5.2
  Bottom 0.508: C5.2 25.63,13.45 C2.2
  Bottom 0.61: C2.2 25.22,13.88 25.96,14.62 27.73,14.62 R3.2

### Text on the board
tNames: 3V3 | 3V3 | P5 | P1 | 3V3 | 3V3 | P4 | P2* | 3V3 | P3 | 3V3
bNames: GND | GND | B | P5 | P1 | C | D | R | GND | GND | P4 | P2* | H09R00 | P3 | GND | GND
LayerStack: Total Thickness 1.6 mm / --------------------------------------------------------- / / copper_top.gbr : Top Conductor - Copper: Thickness 0.035 mm / / Dielectric - FR-4: / / copper_bottom.gbr : Bottom Conductor - Copper: Thickness 0.035 mm